# EAGLE design simple_encoder (EAGLE 9.0.1)
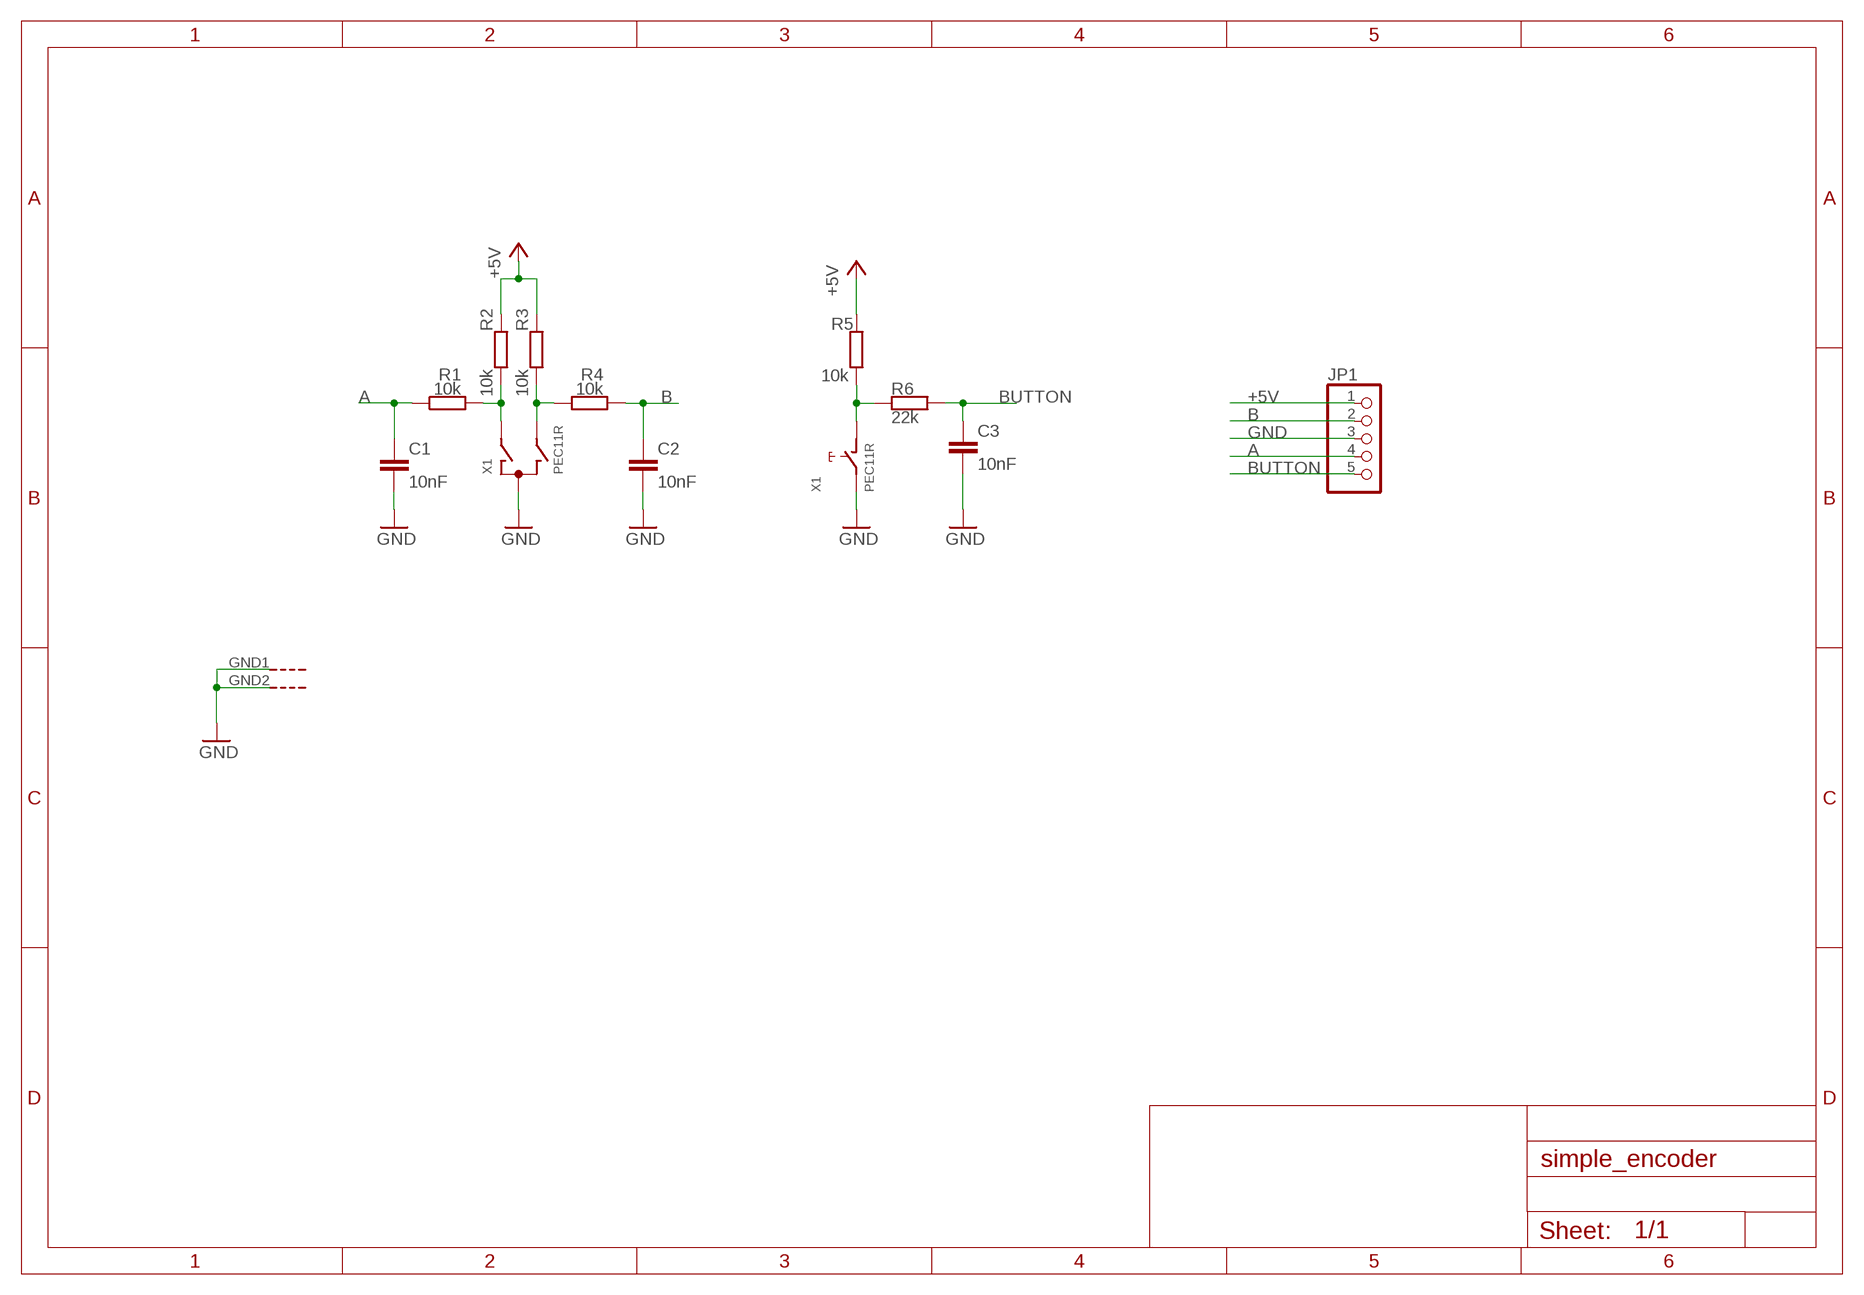
[diagram p0: schematic, sheet 1]

## Parts
C1  10nF  C-EUC0805  [C0805]
C2  10nF  C-EUC0805  [C0805]
C3  10nF  C-EUC0805  [C0805]
JP1  PINHD-1X5  [1X05]
R1  10k  R-EU_R0805  [R0805]
R2  10k  R-EU_R0805  [R0805]
R3  10k  R-EU_R0805  [R0805]
R4  10k  R-EU_R0805  [R0805]
R5  10k  R-EU_R0805  [R0805]
R6  22k  R-EU_R0805  [R0805]
X1  PEC11R  [PEC11R]

## Nets
+5V: JP1.1 R2.2 R3.2 R5.2
A: C1.1 JP1.4 R1.1
A_UNFIL: R1.2 R2.1 X1.A
B: C2.1 JP1.2 R4.2
B_UNFIL: R3.1 R4.1 X1.B
BUTTON: C3.1 JP1.5 R6.2
BUTTON_UNFIL: R5.1 R6.1 X1.D
GND: C1.2 C2.2 C3.2 JP1.3 X1.C X1.E X1.GND1(G) X1.GND2(G)

## Library data of the parts
C1-C3 = rcl:C-EU: CAPACITOR, European symbol; SPICEPREFIX: C
JP1 = pinhead:PINHD-1X5: PIN HEADER
R1-R6 = rcl:R-EU_: RESISTOR, European symbol; SPICEPREFIX: R
X1 = solderpi:PEC11R

## Board
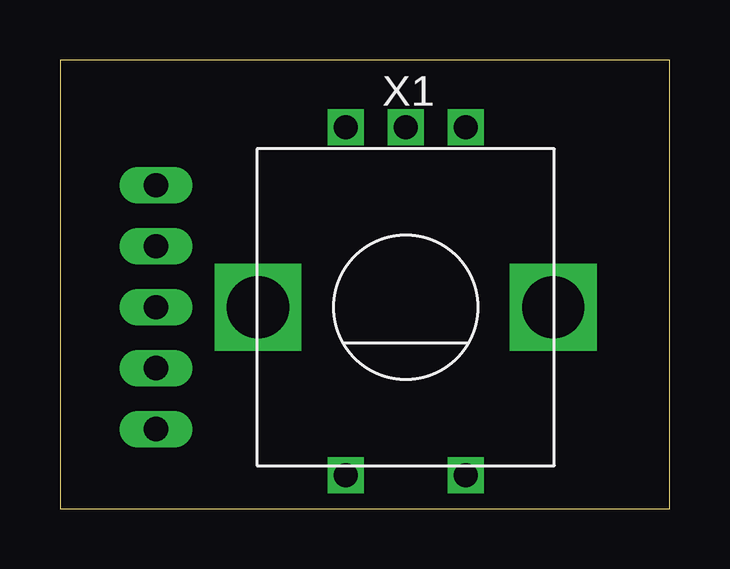
[diagram p1: board, top side]
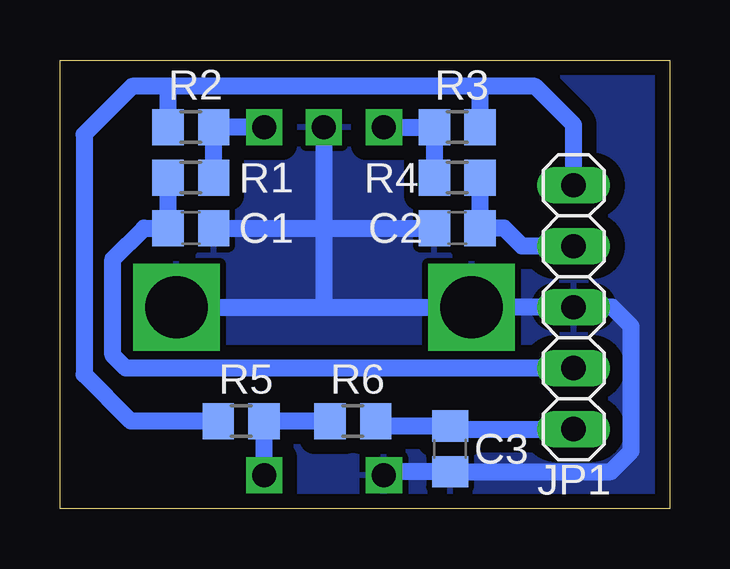
[diagram p2: board, bottom side, seen from below]

Size 25.4 x 18.7 mm. Coordinates in mm from the lower left corner, seen from the top.
Outline: 0,0 25.4,0 25.4,18.7 0,18.7 0,0
Copper layers (1*16): Top 0.035mm / dielectric 1.6mm / Bottom 0.035mm
Design rules "Elecrow_2-layer_PCB_eagle_rule": minimum track width 6mil, minimum drill 12mil, track to track 6mil, track to pad 6mil, pad to pad 6mil, via to via 8mil, smd to smd 0mil, copper to edge 20mil, drill to drill 10mil, minimum pad ring 6mil, minimum via ring 6mil, stop-mask expansion 0mil, vias tented up to drill 100mil, thermal gap 10mil

### Footprints (pad centres in the part's own frame; a part is rotated, then mirrored left to right if it is on the bottom)
C0805 = smd 1.3 x 1.5: 1 -0.95,0; 2 0.95,0
1X05 = drill 1.016 long: 1 -5.08,0; 2 -2.54,0; 3 0,0; 4 2.54,0; 5 5.08,0
R0805 = smd 1.3 x 1.5: 1 -0.95,0; 2 0.95,0
PEC11R = drill 1 square: A -2.5,-7.5; B 2.5,-7.5; C 0,-7.5; D -2.5,7; E 2.5,7 | drill 2.6 square: GND1 -6.15,0; GND2 6.15,0

### Placement (x,y rotation side)
C1  19.95,11.7 0 bottom
C2  8.85,11.7 180 bottom
C3  9.15,2.5 270 bottom
JP1  4,8.4 270 bottom
R1  19.95,13.8 0 bottom
R2  19.95,15.9 180 bottom
R3  8.85,15.9 0 bottom
R4  8.85,13.8 0 bottom
R5  17.85,3.65 180 bottom
R6  13.2,3.65 0 bottom
X1  14.4,8.4 180 top

### Tracks (layer width: path | path; a pad name or v marks a point on that pad's centre or on a via)
+5V
  Bottom 0.7: R5.2 22.45,3.65 24.4,5.6 24.4,15.6 22.4,17.6 20.9,17.6 | JP1.1 4,16 5.6,17.6 7.9,17.6 | 7.9,17.6 20.9,17.6 | R3.2 7.9,17.6 | R2.2 20.9,17.6
A
  Bottom 0.7: R1.1 C1.1 21.9,11.7 23.2,10.4 23.2,6.4 22.66,5.86 JP1.4
A_UNFIL
  Bottom 0.7: R1.2 R2.1 X1.A
B
  Bottom 0.7: R4.2 C2.1 6.9,11.7 6.14,10.94 JP1.2
B_UNFIL
  Bottom 0.7: R4.1 R3.1 X1.B
BUTTON
  Bottom 0.7: R6.2 12.25,3.45 C3.1 9.15,3.32 JP1.5
BUTTON_UNFIL
  Bottom 0.7: X1.D R5.1 R6.1
GND
  Bottom 0.7: C1.2 14.4,11.7 | 14.4,11.7 C2.2 | X1.GND1 14.4,8.4 | 14.4,8.4 X1.GND2 JP1.3 2.4,8.4 1.6,7.6 1.6,2.4 2.45,1.55 C3.2 11.9,1.55 X1.E | X1.C 14.4,11.7 | 14.4,11.7 14.4,8.4
  pour Bottom (isolate 0.61): 0,18.8 25.2,18.8 25.2,0 0,0